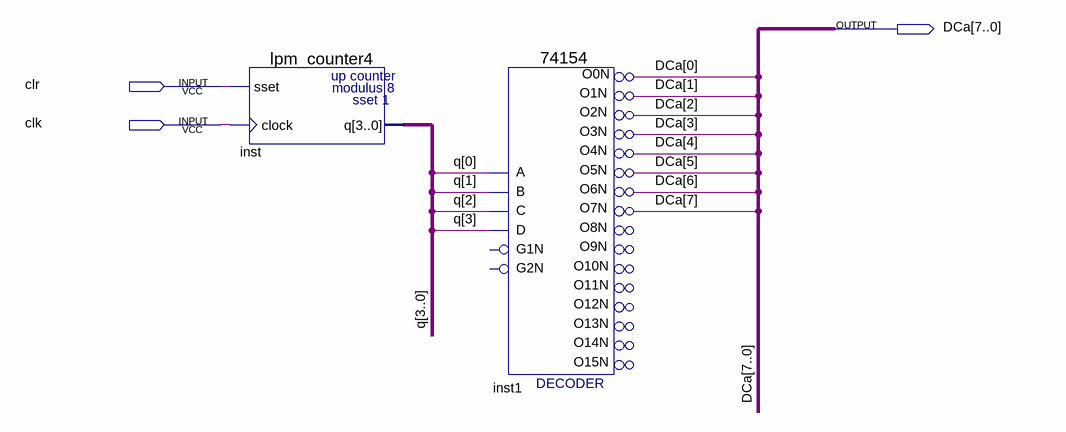
[diagram p0: schematic sheet]
// Quartus schematic DCa.bdf as structural Verilog: 2 symbols, 3 pins
module DCa (
  input  clr,
  input  clk,
  output [7:0] DCa
);

  wire inst1_o0n, inst1_o1n, inst1_o2n, inst1_o3n, inst1_o4n, inst1_o5n, inst1_o6n, inst1_o7n;
  wire [3:0] q;

  lpm_counter4 inst (.sset(clr), .clock(clk), .q(q));
  \74154  inst1 (
    .C(q[2]), .D(q[3]), .B(q[1]), .A(q[0]), .O0N(inst1_o0n), .O1N(inst1_o1n), .O4N(inst1_o4n),
    .O3N(inst1_o3n), .O2N(inst1_o2n), .O7N(inst1_o7n), .O6N(inst1_o6n), .O5N(inst1_o5n));  // open: G1N, G2N, O12N, O15N, O10N, O11N, O13N, O14N, O9N, O8N
  not inst1_O0N_inverted (DCa[0], inst1_o0n);
  not inst1_O1N_inverted (DCa[1], inst1_o1n);
  not inst1_O4N_inverted (DCa[4], inst1_o4n);
  not inst1_O3N_inverted (DCa[3], inst1_o3n);
  not inst1_O2N_inverted (DCa[2], inst1_o2n);
  not inst1_O7N_inverted (DCa[7], inst1_o7n);
  not inst1_O6N_inverted (DCa[6], inst1_o6n);
  not inst1_O5N_inverted (DCa[5], inst1_o5n);
endmodule
